# EAGLE design MainBoard (EAGLE 9.5.2)
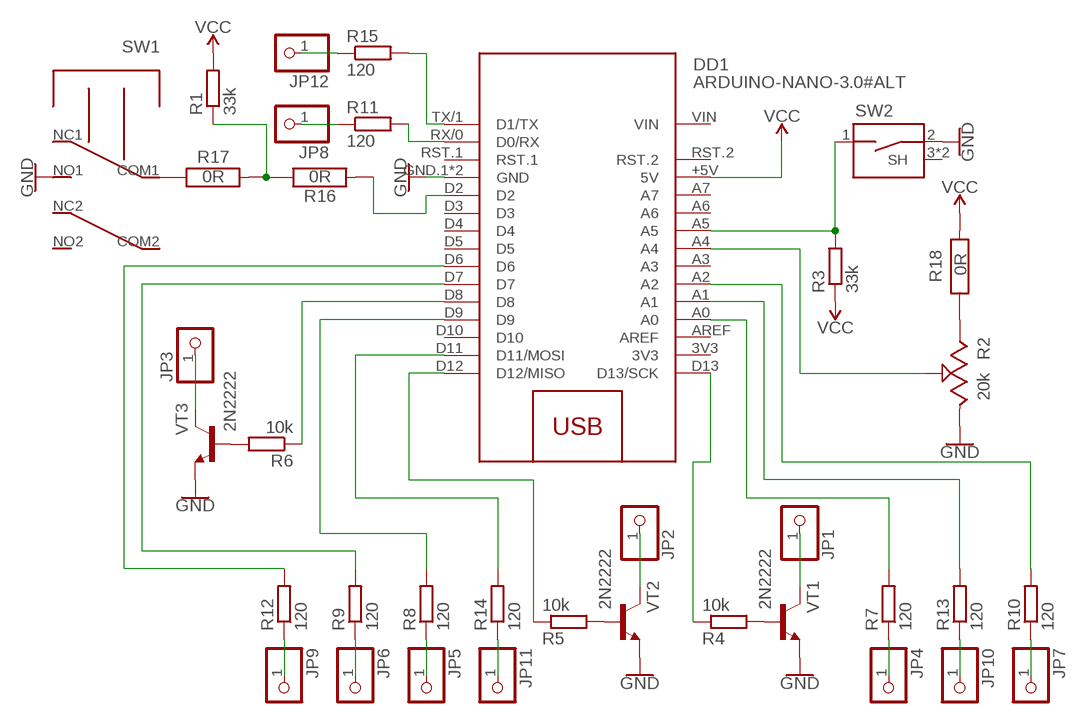
[diagram p0: schematic, sheet 1]

## Parts
DD1  ARDUINO-NANO-3.0#ALT  [ARDUINO-NANO-3.0#ALT]
JP1  PINHD-1X1  [1X01]
JP2  PINHD-1X1  [1X01]
JP3  PINHD-1X1  [1X01]
JP4  PINHD-1X1  [1X01]
JP5  PINHD-1X1  [1X01]
JP6  PINHD-1X1  [1X01]
JP7  PINHD-1X1  [1X01]
JP8  PINHD-1X1  [1X01]
JP9  PINHD-1X1  [1X01]
JP10  PINHD-1X1  [1X01]
JP11  PINHD-1X1  [1X01]
JP12  PINHD-1X1  [1X01]
R1  33k  R-EU_R0805  [R0805]
R2  20k  RV100F-30-4K1B-B10K-B301  [TRIM_RV100F-30-4K1B-B10K-B301]
R3  33k  R-EU_R0805  [R0805]
R4  10k  R-EU_R0805  [R0805]
R5  10k  R-EU_R0805  [R0805]
R6  10k  R-EU_R0805  [R0805]
R7  120  R-EU_R0805  [R0805]
R8  120  R-EU_R0805  [R0805]
R9  120  R-EU_R0805  [R0805]
R10  120  R-EU_R0805  [R0805]
R11  120  R-EU_R0805  [R0805]
R12  120  R-EU_R0805  [R0805]
R13  120  R-EU_R0805  [R0805]
R14  120  R-EU_R0805  [R0805]
R15  120  R-EU_R0805  [R0805]
R16  0R  WRIS-KSKE_2512_560050363011_6.3X3.2X0.6  [WRIS-KSKE_2512_6.3X3.2X0.6(LXWXH)]
R17  0R  WRIS-KSKE_2512_560050363011_6.3X3.2X0.6  [WRIS-KSKE_2512_6.3X3.2X0.6(LXWXH)]
R18  0R  WRIS-KSKE_1206_560050332001_3.1X1.6X0.6X0.3  [WRIS-KSKE_1206_3.1X1.6X0.6X0.3(LXWXHXPW)]
SW1  PS22-F03  [PS-22F03]
SW2  1571610-2  [1571610-2]
VT1  2N2222  TRANS_NPN-MMBT2222AL  [SOT23-3]
VT2  2N2222  TRANS_NPN-MMBT2222AL  [SOT23-3]
VT3  2N2222  TRANS_NPN-MMBT2222AL  [SOT23-3]

## Nets
GND: DD1.GND.1(GND) DD1.GND.2(GND) R2.3 SW1.NO1 SW2.2 VT1.2(E) VT2.2(E) VT3.2(E)
N$1: R1.1 R16.1 R17.2
N$2: DD1.A5 R3.2 SW2.1
N$3: DD1.A4 R2.2
N$4: JP1.1 VT1.3(C)
N$5: R4.2 VT1.1(B)
N$6: R5.2 VT2.1(B)
N$7: R6.2 VT3.1(B)
N$8: JP2.1 VT2.3(C)
N$9: JP3.1 VT3.3(C)
N$10: JP8.1 R11.1
N$11: DD1.D13(D13/SCK) R4.1
N$12: DD1.D8 R6.1
N$13: JP4.1 R7.1
N$14: JP5.1 R8.1
N$15: JP6.1 R9.1
N$16: JP7.1 R10.1
N$17: DD1.RX/0(D0/RX) R11.2
N$18: JP9.1 R12.1
N$19: JP10.1 R13.1
N$20: JP11.1 R14.1
N$21: JP12.1 R15.1
N$22: DD1.A0 R7.2
N$23: DD1.D12(D12/MISO) R5.1
N$24: DD1.D7 R9.2
N$25: DD1.A1 R13.2
N$26: DD1.D6 R12.2
N$27: DD1.D9 R8.2
N$28: DD1.A2 R10.2
N$29: DD1.D11(D11/MOSI) R14.2
N$30: DD1.TX/1(D1/TX) R15.2
N$31: DD1.D2 R16.2
N$32: R17.1 SW1.COM1
N$33: R2.1 R18.1
VCC: DD1.+5V(5V) R1.2 R3.1 R18.2
Unconnected: DD1.A3 DD1.A6 DD1.A7 DD1.AREF DD1.D3 DD1.D4 DD1.D5 DD1.D10 DD1.RST.1 DD1.RST.2 SW1.COM2 SW1.NC1 SW1.NC2 SW1.NO2 SW2.3(SH) SW2.4(SH)

## Power pins joined to a net without a drawn wire
3V3: DD1.3V3
VIN: DD1.VIN

## Library data of the parts
DD1 = diy-modules:ARDUINO-NANO-3.0#ALT: Arduino Nano 3.0 and compatible devices More details available here: https://www.arduino.cc/en/Main/ArduinoBoardNano Click here to find device on ebay.com <http://www.ebay.com/sch/arduino+nano>
JP1-JP12 = adafruit:PINHD-1X1: Pin header 1x1 for 0.1" spacing With round pins
R1 R3-R15 = resistor:R-EU_: RESISTOR, European symbol
R2 = RV100F-30-4K1B-B10K-B301:RV100F-30-4K1B-B10K-B301: Thumbwheel Potentiometers 10mm Linear 10K PC Mount; AVAILABILITY: Unavailable; DESCRIPTION: Thumbwheel Potentiometers 10mm Linear 10K PC Mount; MF: Alpha Taiwan; MOUSER-PURCHASE-URL: https://snapeda.com/shop?store=Mouser&id=1435274; MP: RV100F-30-4K1B-B10K-B301; PACKAGE: None; PRICE: None
R16 R17 = Wurth_Resistor_WRIS-KSKE:WRIS-KSKE_2512: WRIS-KSKE Thick Film Resistors General Purpose Current Sensing Characteristics General purpose current sensing product series Mounting style: SMT-Chip (standard terminal) Resistance range: 50 mΩ ‒ 10 Ω Resistance tolerance: ±1 % Rated Power: 0.125 W ‒ 1 W TCR: ±100; +200; +250; +300 ppm/°C Operating temperature: -55 ��C up to +155°C Sizes: 0402 / 0603 / 0805 / 1206 / 2010 / 2512 Recommended soldering: Reflow soldering Applications DC/DC converter Camera; night vision device Battery management for mobile phone Electric motor control Package name and Variant abbreviation: L X W X H =Length X Width X Height <https://katalog.we-online.com/media/images/v2/o135740v209%20Family_WRIS-KSKE.jpg> Details see: https://katalog.we-online.com/en/pbs/WRIS-KSKE Created by Ella Wu 2019-09-05 2019(C) Wurth Elektronik; DATASHEET-URL: https://katalog.we-online.de/pbs/datasheet/560050363011.pdf; IR: 1.41A; MOUNT: SMT; PART-NUMBER: 560050363011; PRATED: 1W; TCR: ±100ppm/ °C; TECHNICAL-REFERENCE: KE2512R500F101KAATE0000; VALUE: 0.5Ohm
R18 = Wurth_Resistor_WRIS-KSKE:WRIS-KSKE_1206: WRIS-KSKE Thick Film Resistors General Purpose Current Sensing Characteristics General purpose current sensing product series Mounting style: SMT-Chip (standard terminal) Resistance range: 50 mΩ ‒ 10 Ω Resistance tolerance: ±1 % Rated Power: 0.125 W ‒ 1 W TCR: ±100; +200; +250; +300 ppm/°C Operating temperature: -55 °C up to +155°C Sizes: 0402 / 0603 / 0805 / 1206 / 2010 / 2512 Recommended soldering: Reflow soldering Applications DC/DC converter Camera; night vision device Battery management for mobile phone Electric motor control Package name and Variant abbreviation: L X W X H X PW=Length X Width X Height X Pad Width <https://katalog.we-online.com/media/images/v2/o135740v209%20Family_WRIS-KSKE.jpg> Details see: https://katalog.we-online.com/en/pbs/WRIS-KSKE Created by Ella Wu 2019-09-05 2019(C) Wurth Elektronik; DATASHEET-URL: https://katalog.we-online.de/pbs/datasheet/560050332001.pdf; IR: 3.16A; MOUNT: SMT; PART-NUMBER: 560050332001; PRATED: 0.5W; TCR: 250ppm/ °C; TECHNICAL-REFERENCE: KE1206R050F102LAATP0000; VALUE: 0.05Ohm
SW1 = SRD-05VDC-SL-C:PS22-F03
SW2 = Switch:1571610-2: SWITCH TACTILE SPST-NO 0.05A 24V Manufacturer's datasheet <https://www.te.com/commerce/DocumentDelivery/DDEController?Action=srchrtrv&DocNm=1571610&DocType=Customer+Drawing&DocLang=English>; CREATED_BY: PCBLayout.com; DIGIKEY_PN: A117269-ND; MANUFACTURER: TE Connectivity ALCOSWITCH Switches; MPN: 1571610-2
VT1-VT3 = SparkFun-DiscreteSemi:TRANS_NPN: NPN transistor Current controlled devices typically used to amplify current or used as a switch. BC547 - COM-08928 <http://www.sparkfun.com/products/8928> (TO-92 45V 100mA) (1.Collector 2.Base 3.Emitter) 2N3904 - COM-00521 <http://www.sparkfun.com/products/521> (TO-92 40V 200mA) (1.Emitter 2.Base 3.Collector) P2N2222A - COM-12852 <http://www.sparkfun.com/products/12852> (TO-92 40V 600mA) (1.Collector 2.Base 3.Emitter); PROD_ID: TRANS-08049; VALUE: 600mA/40V

## Board
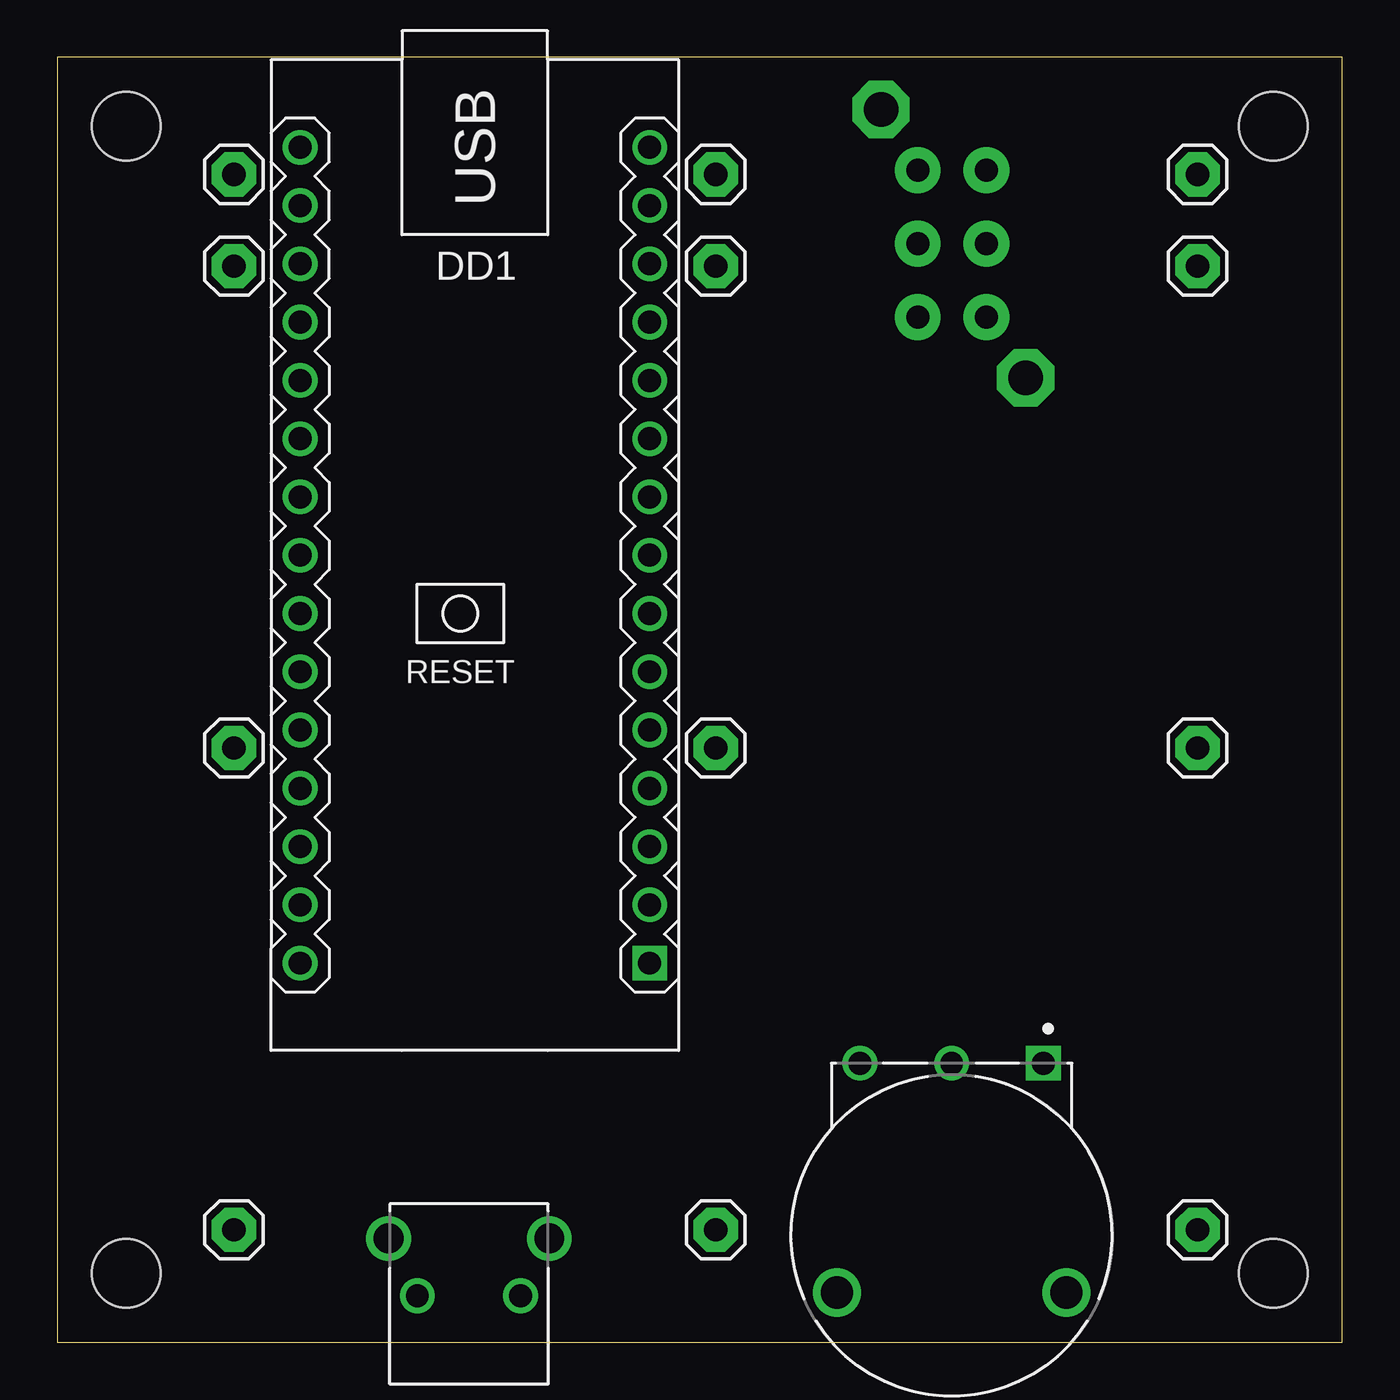
[diagram p1: board, top side]
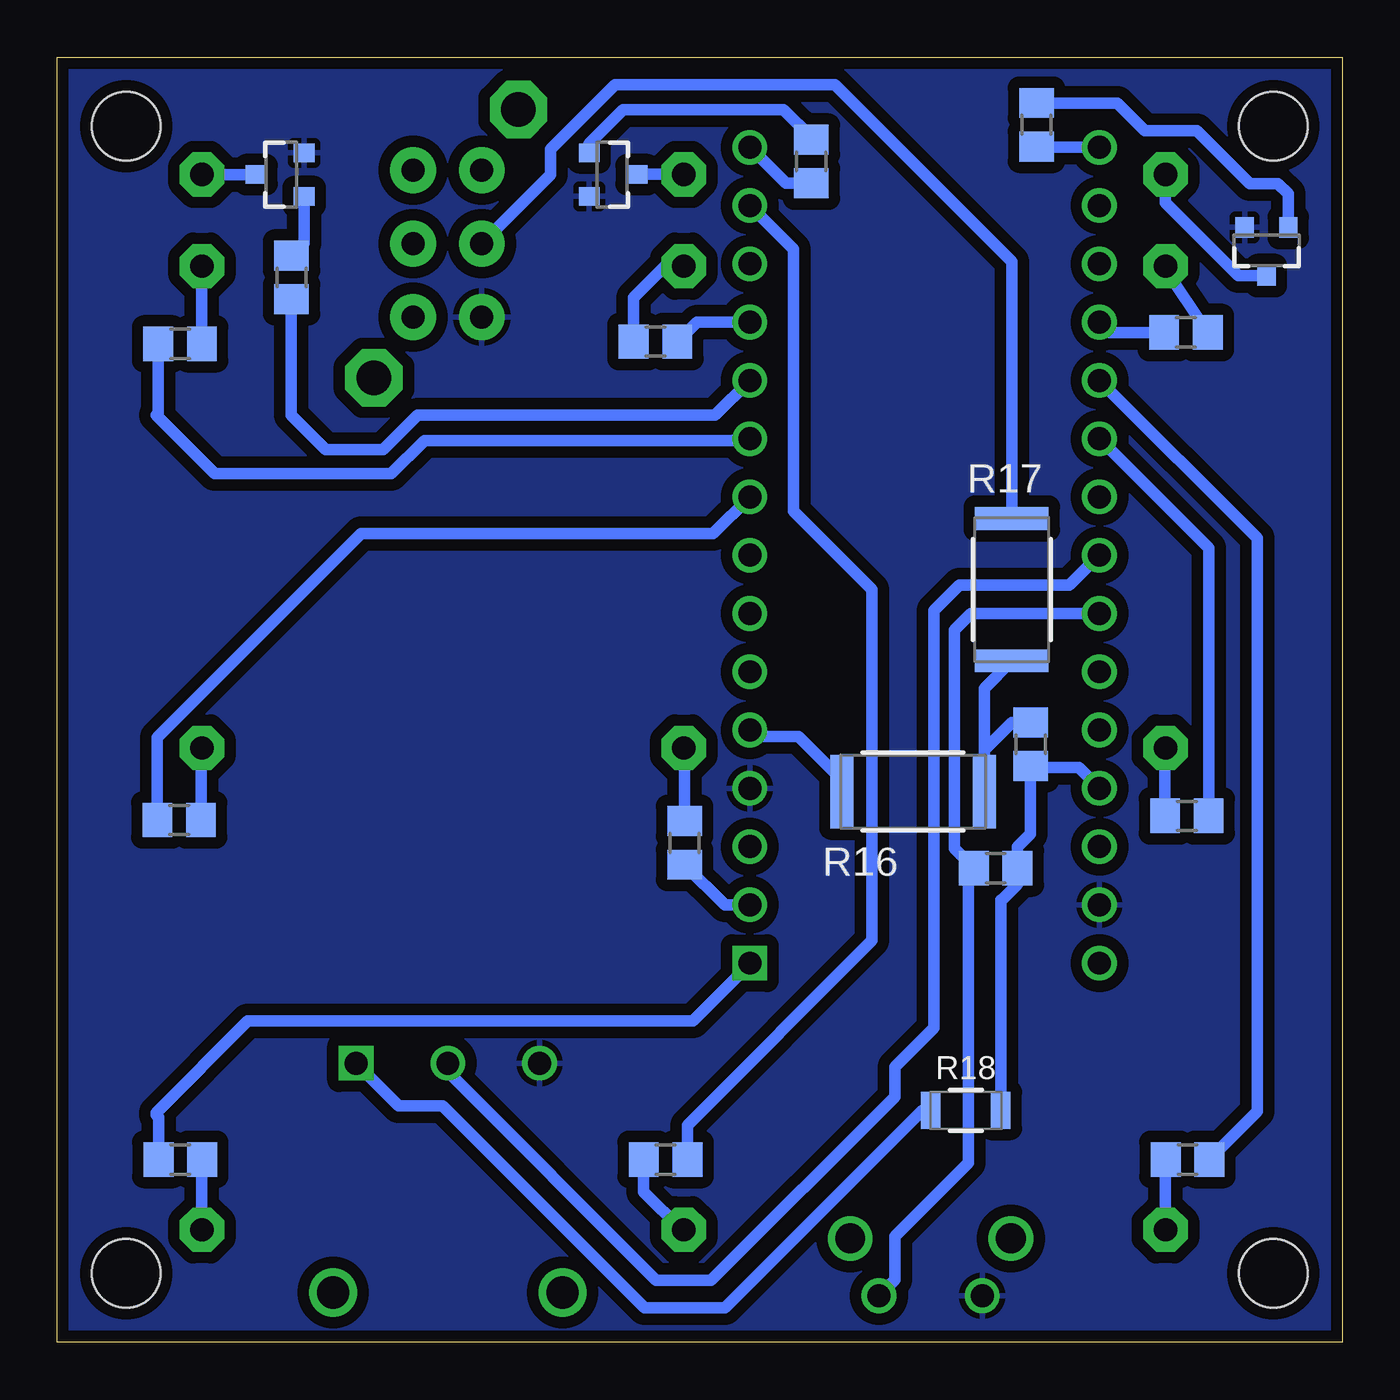
[diagram p2: board, bottom side, seen from below]

Size 56 x 56 mm. Coordinates in mm from the lower left corner, seen from the top.
Outline: 0,0 56,0 56,56 0,56 0,0
Copper layers (1*16): Top 0.035mm / dielectric 1.5mm / Bottom 0.035mm
Design rules "default *": minimum track width 6mil, minimum drill 0.35mm, track to track 6mil, track to pad 6mil, pad to pad 6mil, via to via 6mil, smd to smd 6mil, copper to edge 0.5mm, drill to drill 0.5mm, minimum pad ring 10mil, minimum via ring 8mil, stop-mask expansion 4mil, vias tented up to drill 0mil, thermal gap 10mil
Holes 3 mm at 3,53 53,53 53,3 3,3

### Footprints (pad centres in the part's own frame; a part is rotated, then mirrored left to right if it is on the bottom)
ARDUINO-NANO-3.0#ALT = drill 1: 3V3 -15.24,-7.62; +5V 10.16,-7.62; A0 -10.16,-7.62; A1 -7.62,-7.62; A2 -5.08,-7.62; A3 -2.54,-7.62; A4 0,-7.62; A5 2.54,-7.62; A6 5.08,-7.62; A7 7.62,-7.62; AREF -12.7,-7.62; D2 7.62,7.62; D3 5.08,7.62; D4 2.54,7.62; D5 0,7.62; D6 -2.54,7.62; D7 -5.08,7.62; D8 -7.62,7.62; D9 -10.16,7.62; D10 -12.7,7.62; D11 -15.24,7.62; D12 -17.78,7.62; D13 -17.78,-7.62; GND.1 10.16,7.62; GND.2 15.24,-7.62; RST.1 12.7,7.62; RST.2 12.7,-7.62; RX/0 15.24,7.62; VIN 17.78,-7.62 | drill 1 square: TX/1 17.78,7.62
1X01 = drill 1.016 pad 1.93 octagon: 1 0,0
R0805 = smd 1.3 x 1.5: 1 -0.95,0; 2 0.95,0
TRIM_RV100F-30-4K1B-B10K-B301 = drill 1 square: 1 -4,-7.5 | drill 1: 2 0,-7.5; 3 4,-7.5 | drill 1.4: S1 -5,2.5; S2 5,2.5
WRIS-KSKE_2512_6.3X3.2X0.6(LXWXH) = smd 1 x 3.2: 1 -3.1,0; 2 3.1,0
WRIS-KSKE_1206_3.1X1.6X0.6X0.3(LXWXHXPW) = smd 0.85 x 1.6: 1 -1.525,0; 2 1.525,0
PS-22F03 = drill 1 pad 2: COM1 0,1.5; COM2 0,-1.5; NC1 3.2,1.5; NC2 3.2,-1.5; NO1 -3.2,1.5; NO2 -3.2,-1.5 | drill 1.5 pad 2.5 octagon: SHLD1 5.85,3.1; SHLD2 -5.85,-3.2
1571610-2 = drill 1: 1 -2.25,0; 2 2.25,0 | drill 1.3: 3 -3.5,-2.5; 4 3.5,-2.5
SOT23-3 = smd 0.8 x 0.9: 1 -0.95,-1; 2 0.95,-1; 3 0,1.1

### Placement (x,y rotation side)
DD1  18.2,34.3 270 top
JP1  7.7,50.9 0 top
JP2  28.7,50.9 0 top
JP3  49.7,50.9 0 top
JP4  7.7,46.9 0 top
JP5  28.7,46.9 0 top
JP6  49.7,46.9 0 top
JP7  7.7,25.9 0 top
JP8  28.7,25.9 0 top
JP9  49.7,25.9 0 top
JP10  7.7,4.9 0 top
JP11  28.7,4.9 0 top
JP12  49.7,4.9 0 top
R1  13.58,26.06 270 bottom
R2  38.98,4.66 180 top
R3  15.1,20.66 180 bottom
R4  13.32,53.06 90 bottom
R5  23.14,51.46 90 bottom
R6  45.79,46.41 90 bottom
R7  6.81,44.01 180 bottom
R8  29.93,43.61 0 bottom
R9  50.65,43.51 180 bottom
R10  6.77,22.94 0 bottom
R11  28.66,21.76 270 bottom
R12  50.69,22.76 180 bottom
R13  6.74,7.96 0 bottom
R14  29.49,7.96 0 bottom
R15  50.64,7.96 180 bottom
R16  18.7,24 180 bottom
R17  14.4,32.8 270 bottom
R18  16.4,10.1 0 bottom
SW1  39,47.88 90 top
SW2  17.94,2.02 180 top
VT1  3.3,47.59 180 bottom
VT2  31.82,50.89 270 bottom
VT3  46.24,50.89 90 bottom

### Tracks (layer width: path | path; a pad name or v marks a point on that pad's centre or on a via)
GND
  pour Bottom (isolate 0.5): 0,56 56,56 56,0 0,0
N$1
  Bottom 0.5: R1.1 14.39,27.01 15.6,25.8 | 15.6,25.8 R16.1 | R17.2 15.6,28.5 15.6,25.8
N$2
  Bottom 0.5: SW2.1 19.49,2.72 19.49,4.62 16.3,7.81 16.3,20.66 R3.2 | DD1.A5 16.18,31.76 16.9,31.04 16.9,21.51 R3.2 | 15.9,20.8 R3.2
N$3
  Bottom 0.5: R2.2 38.98,11.78 29.9,2.7 27.5,2.7 19.5,10.7 19.5,12 17.8,13.7 17.8,31.88 16.68,33 11.88,33 DD1.A4
N$4
  Bottom 0.5: VT1.3 4.52,46.49 7.7,49.67 JP1.1
N$5
  Bottom 0.5: R4.2 9.8,54.01 8.59,52.8 6.34,52.8 4.04,50.5 2.8,50.5 2.35,50.05 VT1.1 2.35,48.63
N$6
  Bottom 0.5: R5.2 23.14,52.51 24.34,53.71 31.35,53.71 32.82,52.24 VT2.1
N$7
  Bottom 0.5: VT3.1 45.24,47.91 R6.2
N$8
  Bottom 0.5: JP2.1 VT2.3
N$9
  Bottom 0.5: JP3.1 VT3.3
N$10
  Bottom 0.5: R11.1 28.66,25.86 JP8.1
N$11
  Bottom 0.5: DD1.D13 13.29,52.08 R4.1
N$12
  Bottom 0.5: DD1.D8 27.34,40.4 40.3,40.4 41.8,38.9 44.3,38.9 45.8,40.4 R6.1
N$13
  Bottom 0.5: R7.1 7.76,46.84 JP4.1
N$14
  Bottom 0.5: R8.1 30.88,45.52 29.4,47 28.8,47 JP5.1
N$15
  Bottom 0.5: R9.1 JP6.1
N$16
  Bottom 0.5: JP7.1 7.72,25.88 R10.1
N$17
  Bottom 0.5: DD1.RX/0 26.91,19.06 R11.2
N$18
  Bottom 0.5: R12.1 49.74,25.86 JP9.1
N$19
  Bottom 0.5: JP10.1 R13.1
N$20
  Bottom 0.5: R14.1 30.44,6.56 28.78,4.9 JP11.1
N$21
  Bottom 0.5: JP12.1 R15.1
N$22
  Bottom 0.5: R7.2 10.13,44.01 DD1.A0
N$23
  Bottom 0.5: DD1.D12 24.25,50.51 R5.1
N$24
  Bottom 0.5: R9.2 51.6,40.5 51.7,40.4 49.15,37.85 41.45,37.85 40,39.3 26.5,39.3 26.42,39.38 DD1.D7
N$25
  Bottom 0.5: DD1.A1 3.7,35.04 3.7,10.05 R13.2
N$26
  Bottom 0.5: R12.2 51.64,26.36 42.76,35.24 27.42,35.24 DD1.D6
N$27
  Bottom 0.5: R8.2 28.13,44.46 DD1.D9
N$28
  Bottom 0.5: DD1.A2 5.82,34.62 R10.2
N$29
  Bottom 0.5: DD1.D11 23.92,47.64 23.92,36.22 20.5,32.8 20.5,17.5 28.54,9.46 R14.2
N$30
  Bottom 0.5: R15.2 51.59,9.79 51.7,9.9 51.7,10 47.7,14 28.3,14 25.82,16.48 DD1.TX/1
N$31
  Bottom 0.5: DD1.D2 25.54,26.4 23.7,26.4 21.8,24.5 R16.2
N$32
  Bottom 0.5: SW1.COM1 34.5,50.88 34.5,52 31.7,54.8 22.1,54.8 14.4,47.1 R17.1
N$33
  Bottom 0.5: R2.1 41.12,10.3 39.2,10.3 30.4,1.5 26.9,1.5 18.3,10.1 R18.1
VCC
  Bottom 0.5: DD1.+5V 11.48,25.04 13.51,25.04 R1.2 13.58,22.16 14.15,21.59 R3.1 14.15,19.95 14.85,19.25 14.88,19.27 R18.2